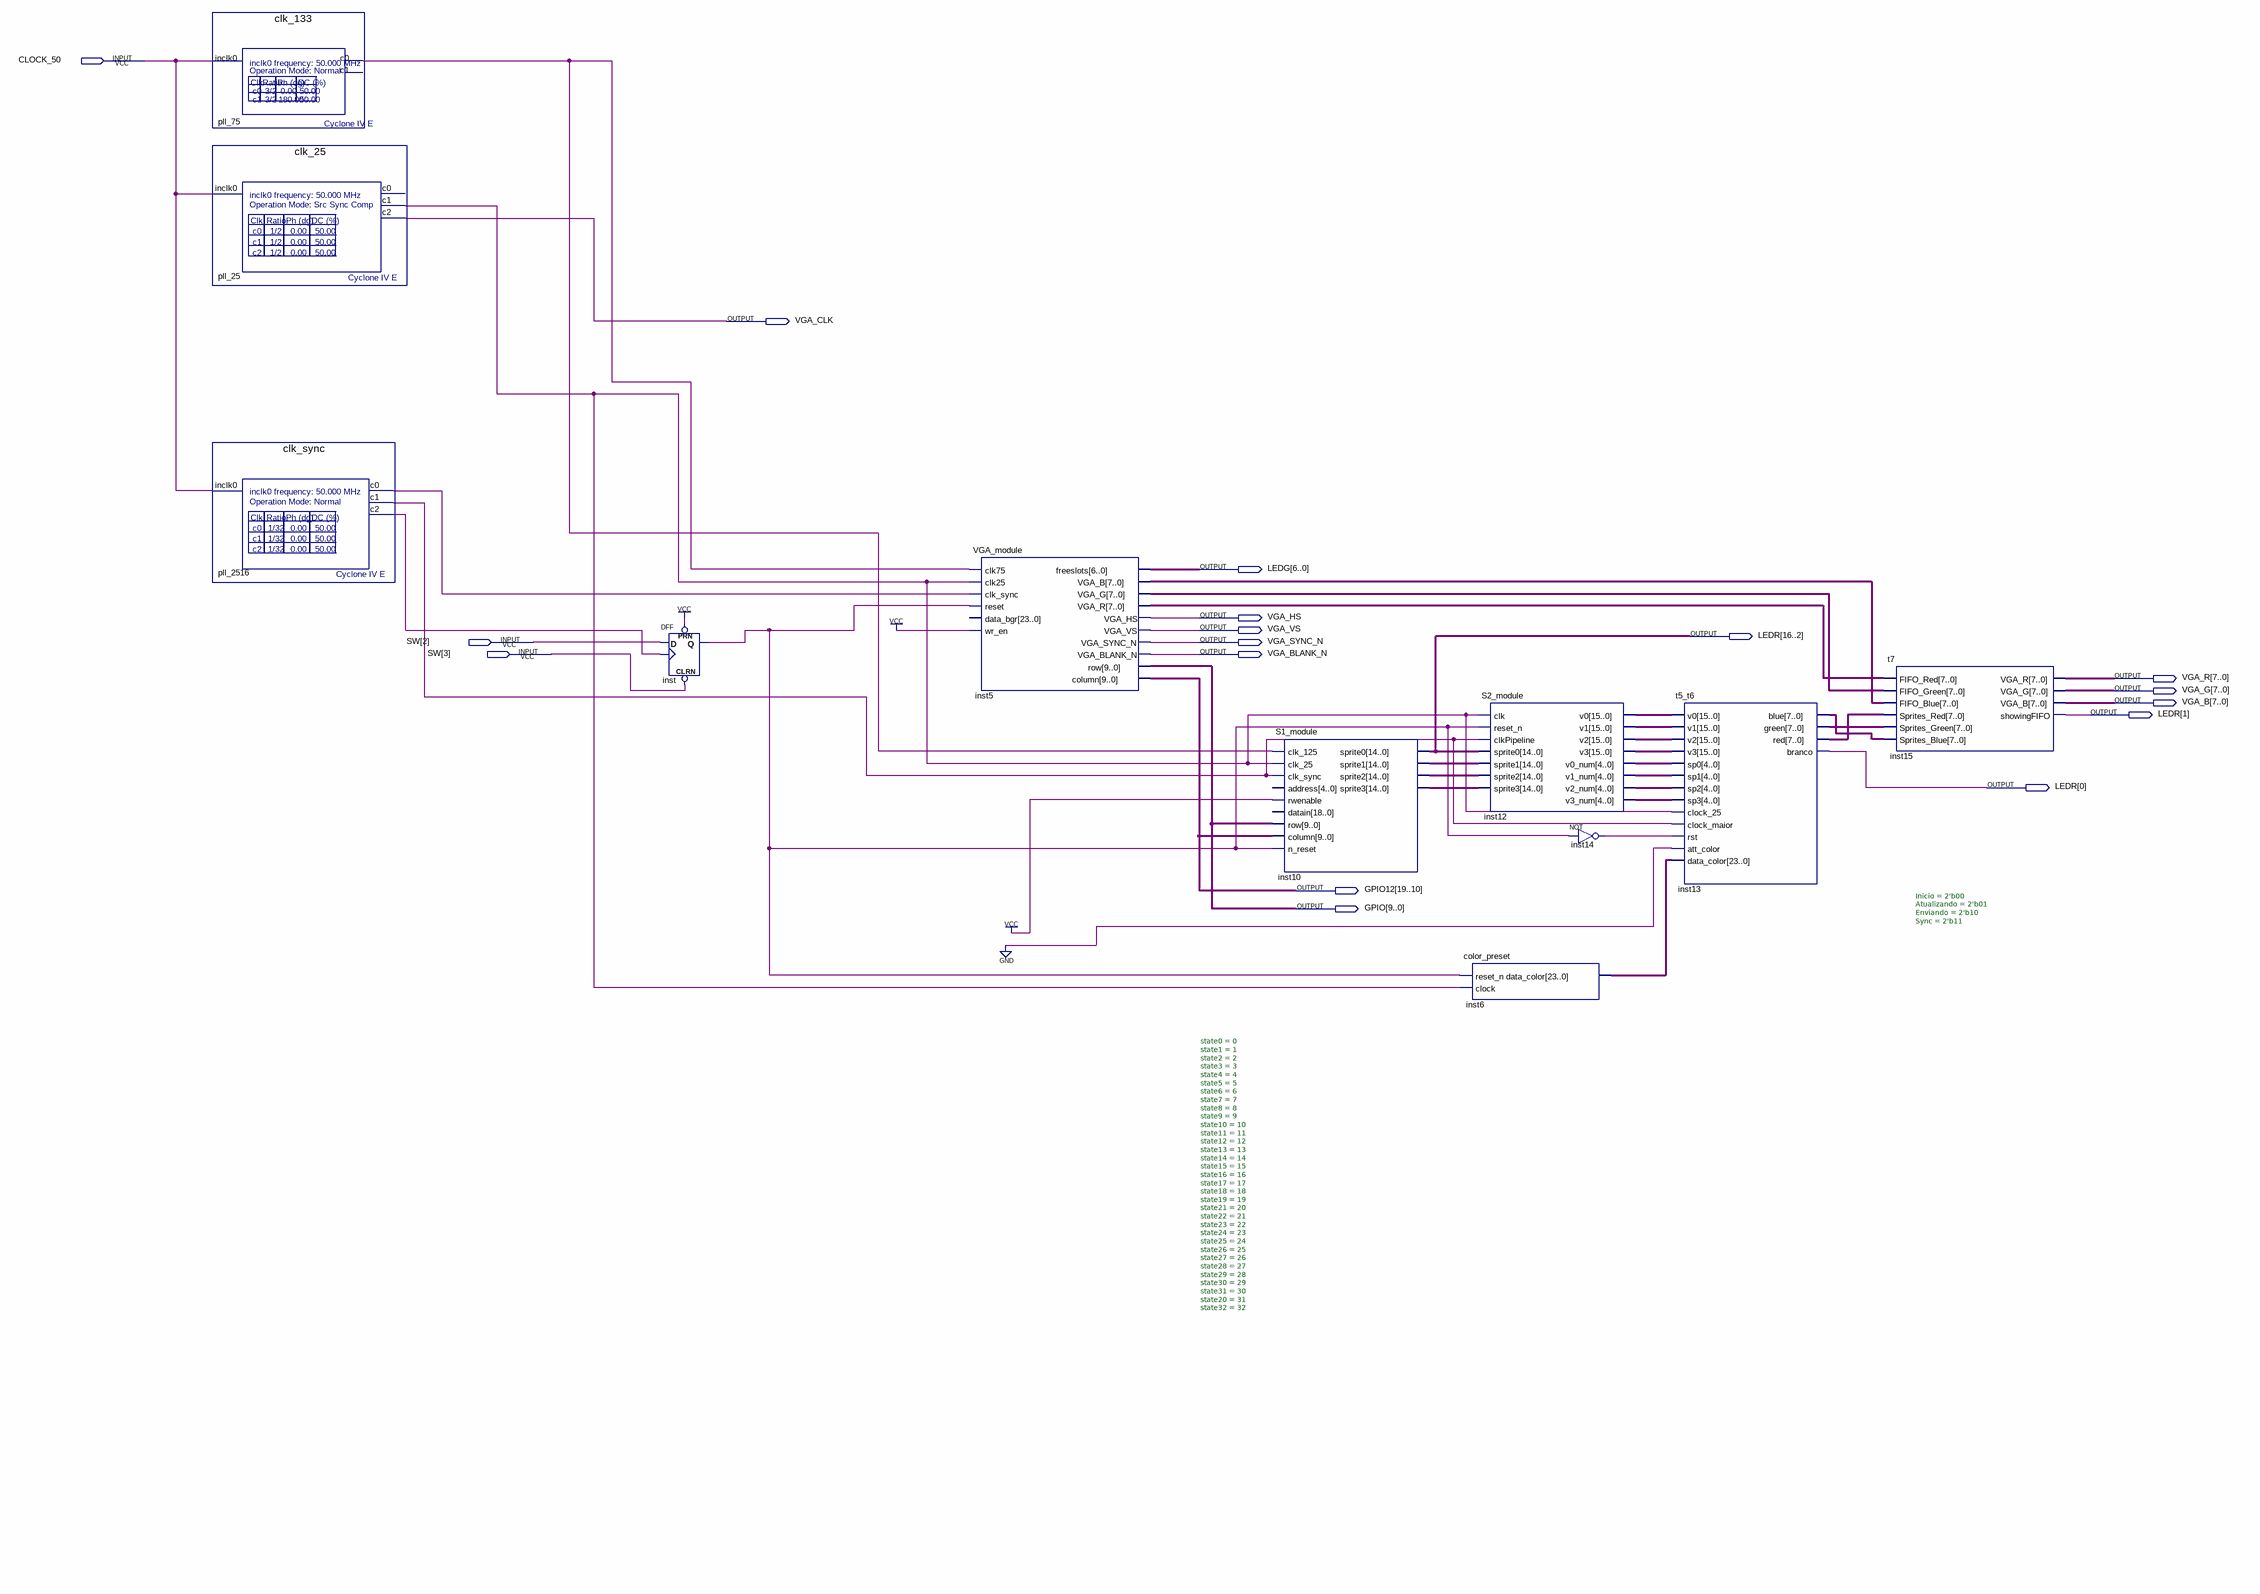
[diagram p0: schematic sheet]
// Quartus schematic testeSpriter.bdf as structural Verilog: 11 symbols, 17 pins
module testeSpriter (
  input  CLOCK_50,
  input  [3:2] SW,
  output VGA_CLK,
  output [6:0] LEDG,
  output VGA_HS,
  output VGA_VS,
  output [16:0] LEDR,
  output VGA_SYNC_N,
  output VGA_BLANK_N,
  output [7:0] VGA_R,
  output [7:0] VGA_G,
  output [7:0] VGA_B,
  output [19:10] GPIO12,
  output [9:0] GPIO
);

  wire inst14_out, inst_q, pll_25_c1, pll_75_c0, pll_2516_c0, pll_2516_c1, pll_2516_c2;
  wire [4:0] inst12_v0_num, inst12_v1_num, inst12_v2_num, inst12_v3_num;
  wire [7:0] inst5_vga_b, inst5_vga_g, inst5_vga_r, inst13_blue, inst13_green, inst13_red;
  wire [14:0] inst10_sprite1, inst10_sprite2, inst10_sprite3;
  wire [15:0] inst12_v0, inst12_v1, inst12_v2, inst12_v3;
  wire [23:0] inst6_data_color;

  clk_133 pll_75 (.inclk0(CLOCK_50), .c0(pll_75_c0));  // open: c1
  clk_25 pll_25 (.inclk0(CLOCK_50), .c1(pll_25_c1), .c2(VGA_CLK));  // open: c0
  clk_sync pll_2516 (.inclk0(CLOCK_50), .c0(pll_2516_c0), .c1(pll_2516_c1), .c2(pll_2516_c2));
  DFF inst (.CLRN(SW[3]), .CLK(pll_2516_c2), .D(SW[2]), .PRN(1'b1), .Q(inst_q));
  VGA_module inst5 (
    .clk75(pll_75_c0), .clk25(pll_25_c1), .clk_sync(pll_2516_c0), .reset(inst_q), .wr_en(1'b1),
    .freeslots(LEDG), .VGA_B(inst5_vga_b), .VGA_G(inst5_vga_g), .VGA_R(inst5_vga_r), .VGA_HS(VGA_HS),
    .VGA_VS(VGA_VS), .VGA_SYNC_N(VGA_SYNC_N), .VGA_BLANK_N(VGA_BLANK_N), .row(GPIO), .column(GPIO12));  // open: data_bgr
  S1_module inst10 (
    .clk_125(pll_75_c0), .clk_25(pll_25_c1), .clk_sync(pll_2516_c1), .rwenable(1'b1), .row(GPIO),
    .column(GPIO12), .n_reset(inst_q), .sprite0(LEDR[16:2]), .sprite1(inst10_sprite1),
    .sprite2(inst10_sprite2), .sprite3(inst10_sprite3));  // open: address, datain
  S2_module inst12 (
    .clk(pll_25_c1), .reset_n(inst_q), .clkPipeline(pll_2516_c1), .sprite0(LEDR[16:2]),
    .sprite1(inst10_sprite1), .sprite2(inst10_sprite2), .sprite3(inst10_sprite3), .v0(inst12_v0),
    .v1(inst12_v1), .v2(inst12_v2), .v3(inst12_v3), .v0_num(inst12_v0_num), .v1_num(inst12_v1_num),
    .v2_num(inst12_v2_num), .v3_num(inst12_v3_num));
  color_preset #(.state0(0), .state1(1), .state2(2), .state3(3), .state4(4), .state5(5), .state6(6), .state7(7), .state8(8), .state9(9), .state10(10), .state11(11), .state12(12), .state13(13), .state14(14), .state15(15), .state16(16), .state17(17), .state18(18), .state19(19), .state21(20), .state22(21), .state23(22), .state24(23), .state25(24), .state26(25), .state27(26), .state28(27), .state29(28), .state30(29), .state31(30), .state20(31), .state32(32)) inst6 (
    .reset_n(inst_q), .clock(pll_25_c1), .data_color(inst6_data_color));
  not inst14 (inst14_out, inst_q);
  t5_t6 #(.Inicio(2'b00), .Atualizando(2'b01), .Enviando(2'b10), .Sync(2'b11)) inst13 (
    .v0(inst12_v0), .v1(inst12_v1), .v2(inst12_v2), .v3(inst12_v3), .sp0(inst12_v0_num), .sp1(inst12_v1_num),
    .sp2(inst12_v2_num), .sp3(inst12_v3_num), .clock_25(pll_25_c1), .clock_maior(pll_2516_c1),
    .rst(inst14_out), .att_color(1'b0), .data_color(inst6_data_color), .blue(inst13_blue),
    .green(inst13_green), .red(inst13_red), .branco(LEDR[0]));
  t7 inst15 (
    .FIFO_Red(inst5_vga_r), .FIFO_Green(inst5_vga_g), .FIFO_Blue(inst5_vga_b), .Sprites_Red(inst13_red),
    .Sprites_Green(inst13_green), .Sprites_Blue(inst13_blue), .VGA_R(VGA_R), .VGA_G(VGA_G), .VGA_B(VGA_B),
    .showingFIFO(LEDR[1]));
endmodule
